# Altium schematic sheet ESP32Cam Mounting Schematic.SchDoc
size A4; SheetNumber: 1; SheetTotal: 1
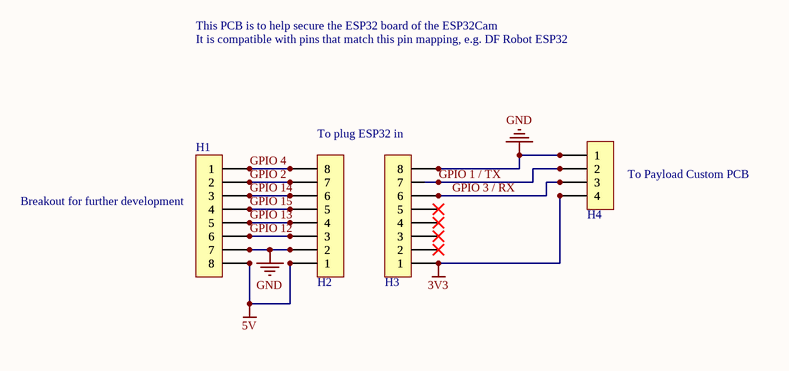
[diagram p0: ESP32Cam Mounting Schematic.SchDoc]

## Parts
H1  8 Pin Header  [8 Pin Header]  (value not drawn)  (no BOM)
H2  8 Pin Header  [8 Pin Header]  (value not drawn)  (no BOM)
H3  8 Pin Header  [8 Pin Header]  (value not drawn)  (no BOM)
H4  Header - 2.54mm,1x4-pin  [HEADER_2.54MM_1x4PIN]  (value not drawn)  (no BOM)

## Nets
3V3: H3.1 H4.4
5V: H1.8 H2.1
GND: H1.7 H2.2 H3.8 H4.1
GPIO 1 / TX: H3.7 H4.2
GPIO 2: H1.2 H2.7
GPIO 3 / RX: H3.6 H4.3
GPIO 4: H1.1 H2.8
GPIO 12: H1.6 H2.3
GPIO 13: H1.5 H2.4
GPIO 14: H1.3 H2.6
GPIO 15: H1.4 H2.5

Not connected (* = marked no-connect by the designer): H3 2* 3* 4* 5*

## Notes on the sheet
- This PCB is to help secure the ESP32 board of the ESP32Cam
- It is compatible with pins that match this pin mapping, e.g. DF Robot ESP32
- To plug ESP32 in
- (near H1) Breakout for further development
- (near H4) To Payload Custom PCB